# Altium schematic sheet PWM_Chanels.SchDoc
size A4
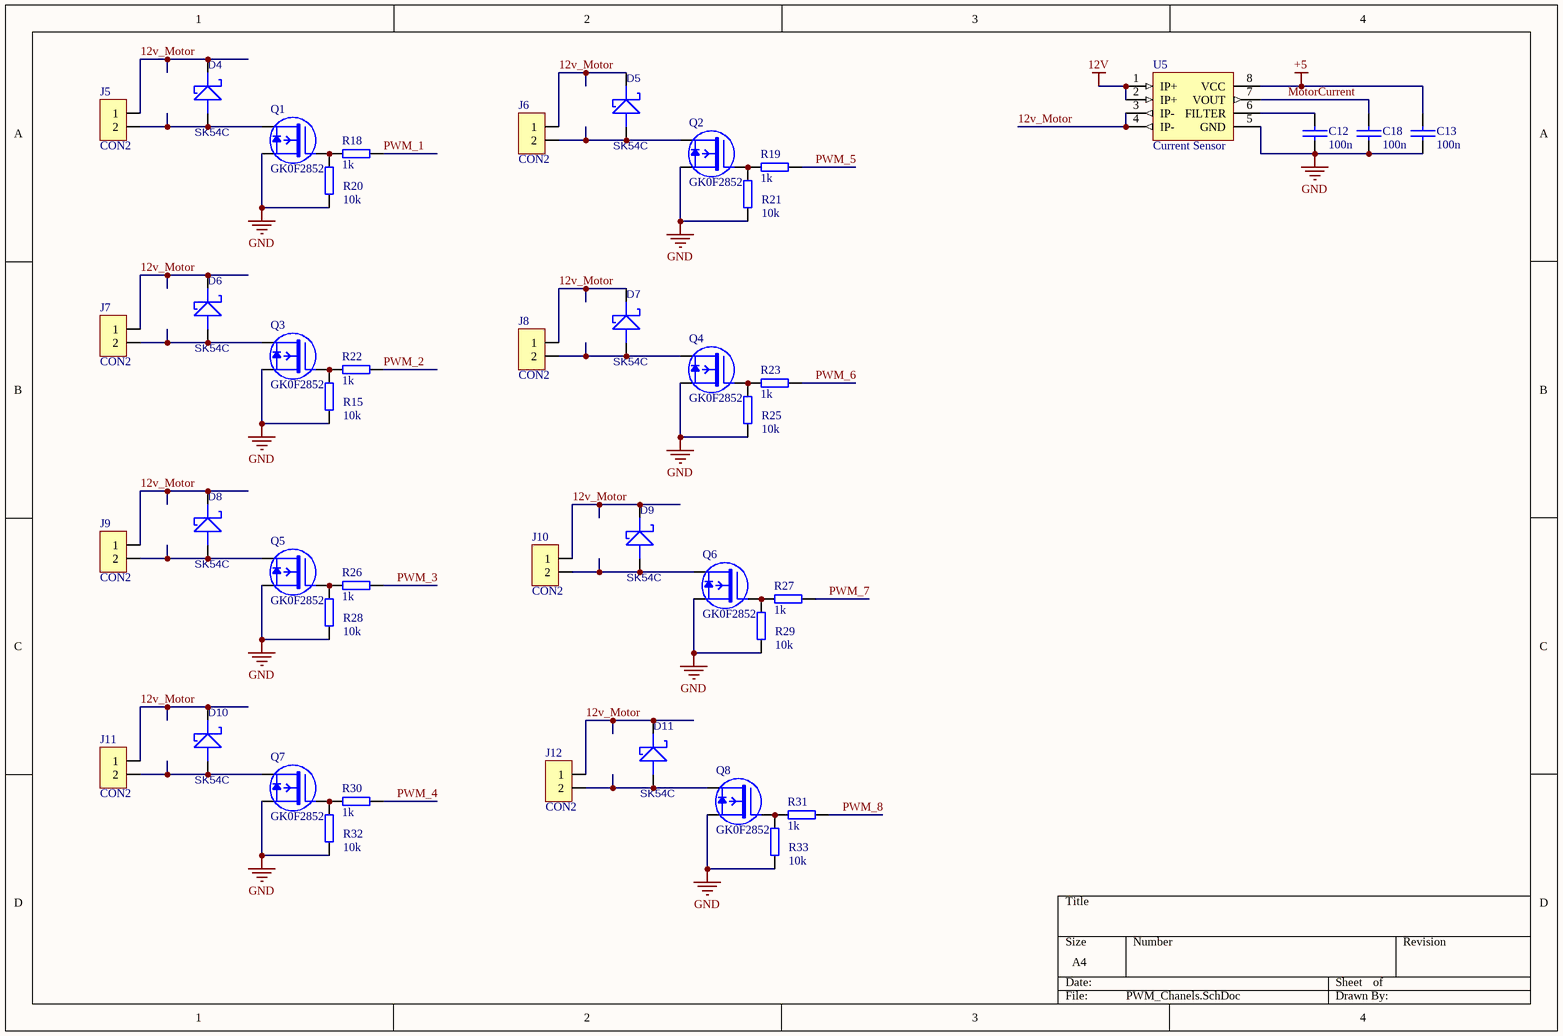
[diagram p0: PWM_Chanels.SchDoc]

## Parts
C12  100n  [0603]
C13  100n  [0603]
C18  100n  [0603]
D4  SK54C  [SMC]
D5  SK54C  [SMC]
D6  SK54C  [SMC]
D7  SK54C  [SMC]
D8  SK54C  [SMC]
D9  SK54C  [SMC]
D10  SK54C  [SMC]
D11  SK54C  [SMC]
J5  CON2  [WEID2R]
J6  CON2  [WEID2R]
J7  CON2  [WEID2R]
J8  CON2  [WEID2R]
J9  CON2  [WEID2R]
J10  CON2  [WEID2R]
J11  CON2  [WEID2R]
J12  CON2  [WEID2R]
Q1  GK0F2852  [TO-251]
Q2  GK0F2852  [TO-251]
Q3  GK0F2852  [TO-251]
Q4  GK0F2852  [TO-251]
Q5  GK0F2852  [TO-251]
Q6  GK0F2852  [TO-251]
Q7  GK0F2852  [TO-251]
Q8  GK0F2852  [TO-251]
R15  10k  [0603]
R18  1k  [0603]
R19  1k  [0603]
R20  10k  [0603]
R21  10k  [0603]
R22  1k  [0603]
R23  1k  [0603]
R25  10k  [0603]
R26  1k  [0603]
R27  1k  [0603]
R28  10k  [0603]
R29  10k  [0603]
R30  1k  [0603]
R31  1k  [0603]
R32  10k  [0603]
R33  10k  [0603]
U5  Current Sensor  [so-8]

## Nets
12V: U5.1(IP+) U5.2(IP+)
+5: C13.2 U5.8(VCC)
GND: C12.1 C13.1 C18.1 Q1.S Q2.S Q3.S Q4.S Q5.S Q6.S Q7.S Q8.S R15.2 R20.2 R21.2 R25.2 R28.2 R29.2 R32.2 R33.2 U5.5(GND)
12v_Motor: D4.K D5.K D6.K D7.K D8.K D9.K D10.K D11.K J5.1 J6.1 J7.1 J8.1 J9.1 J10.1 J11.1 J12.1 U5.3(IP-) U5.4(IP-)
MotorCurrent: C18.2 U5.7(VOUT)
PWM_1: R18.1
PWM_2: R22.1
PWM_3: R26.1
PWM_4: R30.1
PWM_5: R19.1
PWM_6: R23.1
PWM_7: R27.1
PWM_8: R31.1
NetC12_2: C12.2 U5.6(FILTER)
NetD4_A: D4.A J5.2 Q1.D
NetD5_A: D5.A J6.2 Q2.D
NetD6_A: D6.A J7.2 Q3.D
NetD7_A: D7.A J8.2 Q4.D
NetD8_A: D8.A J9.2 Q5.D
NetD9_A: D9.A J10.2 Q6.D
NetD10_A: D10.A J11.2 Q7.D
NetD11_A: D11.A J12.2 Q8.D
NetQ1_G: Q1.G R18.2 R20.1
NetQ2_G: Q2.G R19.2 R21.1
NetQ3_G: Q3.G R15.1 R22.2
NetQ4_G: Q4.G R23.2 R25.1
NetQ5_G: Q5.G R26.2 R28.1
NetQ6_G: Q6.G R27.2 R29.1
NetQ7_G: Q7.G R30.2 R32.1
NetQ8_G: Q8.G R31.2 R33.1

## Library data of the parts
C12 C13 C18 = CAP
D4-D11 = DIODE SCHOTTKY: PartNo: 1299291; Supplier: Element14
Q1-Q8 = MOSFET-N1DSML
R15 R18-R23 R25-R33 = RES8
U5 = ACS714: +/- XA Current Sensor; Supplier: Digi-key